# Altium schematic sheet Sheet2.SchDoc
size A
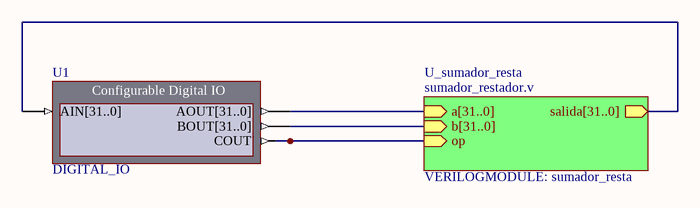
[diagram p0: Sheet2.SchDoc]

## Parts
U1  DIGITAL_IO

## Sub-sheets
U_sumador_resta = sumador_restador.v: a[31..0] (in), b[31..0] (in), op (in), salida[31..0] (out)  | VERILOGMODULE: sumador_resta

## Nets
NetU1_AIN[31..0]: U1.AIN[31..0] ; sheet U_sumador_resta/salida[31..0]
NetU1_AOUT[31..0]: U1.AOUT[31..0] ; sheet U_sumador_resta/a[31..0]
NetU1_BOUT[31..0]: U1.BOUT[31..0] ; sheet U_sumador_resta/b[31..0]
NetU1_COUT: U1.COUT ; sheet U_sumador_resta/op

## Library data of the parts
U1 = DIGITAL_IO: Configurable Digital IO; NEXUS_CORE: Instrument; NEXUS_JTAG_DEVICE: True; NEXUS_JTAG_ORDER: 0; ConfigurationParameters: {}Version[2.0]{}StorageType[3]{}InterfaceType[Parallel]{}SchCompWidth[140]{}Input0Name[AIN{1}31..0{2}]{}Input0Width[32]{}Input0InitValue[0]{}Input0Kind[Numeric]{}Input0NumRadix[Decimal]{}Output0Name[AOUT{1}31..0{2}]{}Output0Width[32]{}Output0InitValue[0]{}Output0Kind[Numeric]{}Output0NumRadix[Decimal]{}Output1Name[BOUT{1}31..0{2}]{}Output1Width[32]{}Output1InitValue[0]{}Output1Kind[Numeric]{}Output1NumRadix[Decimal]{}Output2Name[COUT]{}Output2Width[1]{}Output2InitValue[0]{}Output2Kind[Numeric]{}Output2NumRadix[Binary]{}Designator[U1]{}InternalID[0]{}; ConfiguratorName: DIGITAL_IO; ComponentLink1Description: Core &Resource Usage; ComponentLink1URL: CR0134 FPGA Instrument Resource Usage.pdf; Core Revision: 1.00.00; HelpURL: https://wiki.altium.com/display/ADOH/Digital+IO+Module; LastRevisionNo: 1.00.00; Published: 28-Jun-2007; Publisher: Altium Limited; UseInDSF: True